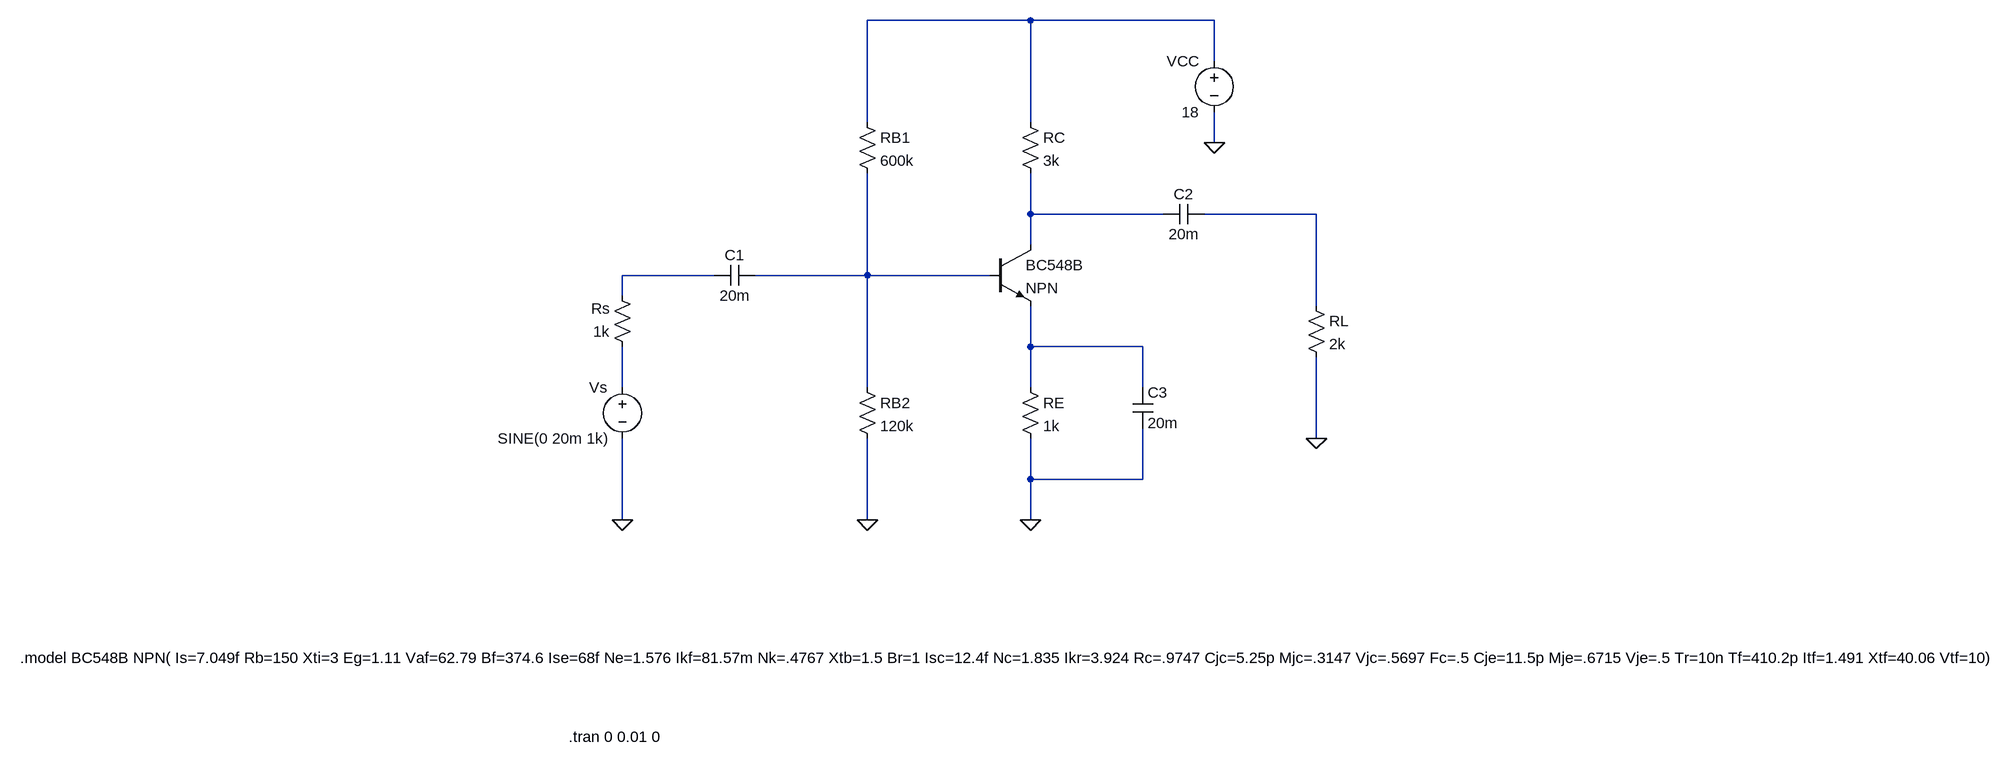
[diagram p0: schematic Draft1.asc]
Draft1.asc, the LTspice schematic file:
Version 4
SHEET 1 3472 1268
WIRE 256 -624 0 -624
WIRE 544 -624 256 -624
WIRE 544 -560 544 -624
WIRE 0 -464 0 -624
WIRE 256 -464 256 -624
WIRE 544 -432 544 -480
WIRE 256 -320 256 -384
WIRE 464 -320 256 -320
WIRE 704 -320 528 -320
WIRE 256 -272 256 -320
WIRE -240 -224 -384 -224
WIRE 0 -224 0 -384
WIRE 0 -224 -176 -224
WIRE 192 -224 0 -224
WIRE -384 -192 -384 -224
WIRE 704 -176 704 -320
WIRE 256 -112 256 -176
WIRE 432 -112 256 -112
WIRE -384 -48 -384 -112
WIRE 0 -48 0 -224
WIRE 256 -48 256 -112
WIRE 432 -48 432 -112
WIRE 704 32 704 -96
WIRE 256 96 256 32
WIRE 432 96 432 16
WIRE 432 96 256 96
WIRE -384 160 -384 32
WIRE 0 160 0 32
WIRE 256 160 256 96
FLAG 0 160 0
FLAG 256 160 0
FLAG 704 32 0
FLAG -384 160 0
FLAG 544 -432 0
SYMBOL npn 192 -272 R0
SYMATTR InstName BC548B
SYMBOL res 240 -480 R0
SYMATTR InstName RC
SYMATTR Value 3k
SYMBOL res 240 -64 R0
SYMATTR InstName RE
SYMATTR Value 1k
SYMBOL res -16 -480 R0
SYMATTR InstName RB1
SYMATTR Value 600k
SYMBOL res -16 -64 R0
SYMATTR InstName RB2
SYMATTR Value 120k
SYMBOL res -368 -96 R180
WINDOW 0 36 76 Left 2
WINDOW 3 36 40 Left 2
SYMATTR InstName Rs
SYMATTR Value 1k
SYMBOL res 688 -192 R0
SYMATTR InstName RL
SYMATTR Value 2k
SYMBOL voltage -384 -64 M0
WINDOW 123 0 0 Left 2
WINDOW 39 0 0 Left 2
SYMATTR InstName Vs
SYMATTR Value SINE(0 20m 1k)
SYMBOL voltage 544 -576 M0
WINDOW 123 0 0 Left 2
WINDOW 39 0 0 Left 2
SYMATTR InstName VCC
SYMATTR Value 18
SYMBOL cap -176 -240 R90
WINDOW 0 0 32 VBottom 2
WINDOW 3 32 32 VTop 2
SYMATTR InstName C1
SYMATTR Value 20m
SYMBOL cap 528 -336 R90
WINDOW 0 0 32 VBottom 2
WINDOW 3 32 32 VTop 2
SYMATTR InstName C2
SYMATTR Value 20m
SYMBOL cap 416 -48 R0
SYMATTR InstName C3
SYMATTR Value 20m
TEXT -1328 376 Left 2 !.model BC548B NPN( Is=7.049f Rb=150 Xti=3 Eg=1.11 Vaf=62.79 Bf=374.6 Ise=68f Ne=1.576 Ikf=81.57m Nk=.4767 Xtb=1.5 Br=1 Isc=12.4f Nc=1.835 Ikr=3.924 Rc=.9747 Cjc=5.25p Mjc=.3147 Vjc=.5697 Fc=.5 Cje=11.5p Mje=.6715 Vje=.5 Tr=10n Tf=410.2p Itf=1.491 Xtf=40.06 Vtf=10)
TEXT -468 500 Left 2 !.tran 0 0.01 0

The netlist it stands for:
* Draft1.asc
Q§BC548B N002 N005 N006 0 NPN
RC N001 N002 3k
RE N006 0 1k
RB1 N001 N005 600k
RB2 N005 0 120k
Rs N007 N004 1k
RL N003 0 2k
Vs N007 0 SINE(0 20m 1k)
VCC N001 0 18
C1 N005 N004 20m
C2 N003 N002 20m
C3 N006 0 20m
.model NPN NPN
.model PNP PNP
.lib standard.bjt
.model BC548B NPN( Is=7.049f Rb=150 Xti=3 Eg=1.11 Vaf=62.79 Bf=374.6 Ise=68f Ne=1.576 Ikf=81.57m Nk=.4767 Xtb=1.5 Br=1 Isc=12.4f Nc=1.835 Ikr=3.924 Rc=.9747 Cjc=5.25p Mjc=.3147 Vjc=.5697 Fc=.5 Cje=11.5p Mje=.6715 Vje=.5 Tr=10n Tf=410.2p Itf=1.491 Xtf=40.06 Vtf=10)
.tran 0 0.01 0
.backanno
.end